# Altium schematic sheet ORD_POWER.SchDoc
size 420 x 297 mm; Address1: Address1; Address2: Address2; Address3: Address3; Address4: Address4; DocumentNumber: АБВГ.123456.001 Э3; SheetNumber: 1; Scale: 1:1; DocumentType: Схема электрическая принципиальная; FirstReferrence: АБВГ.123456.001
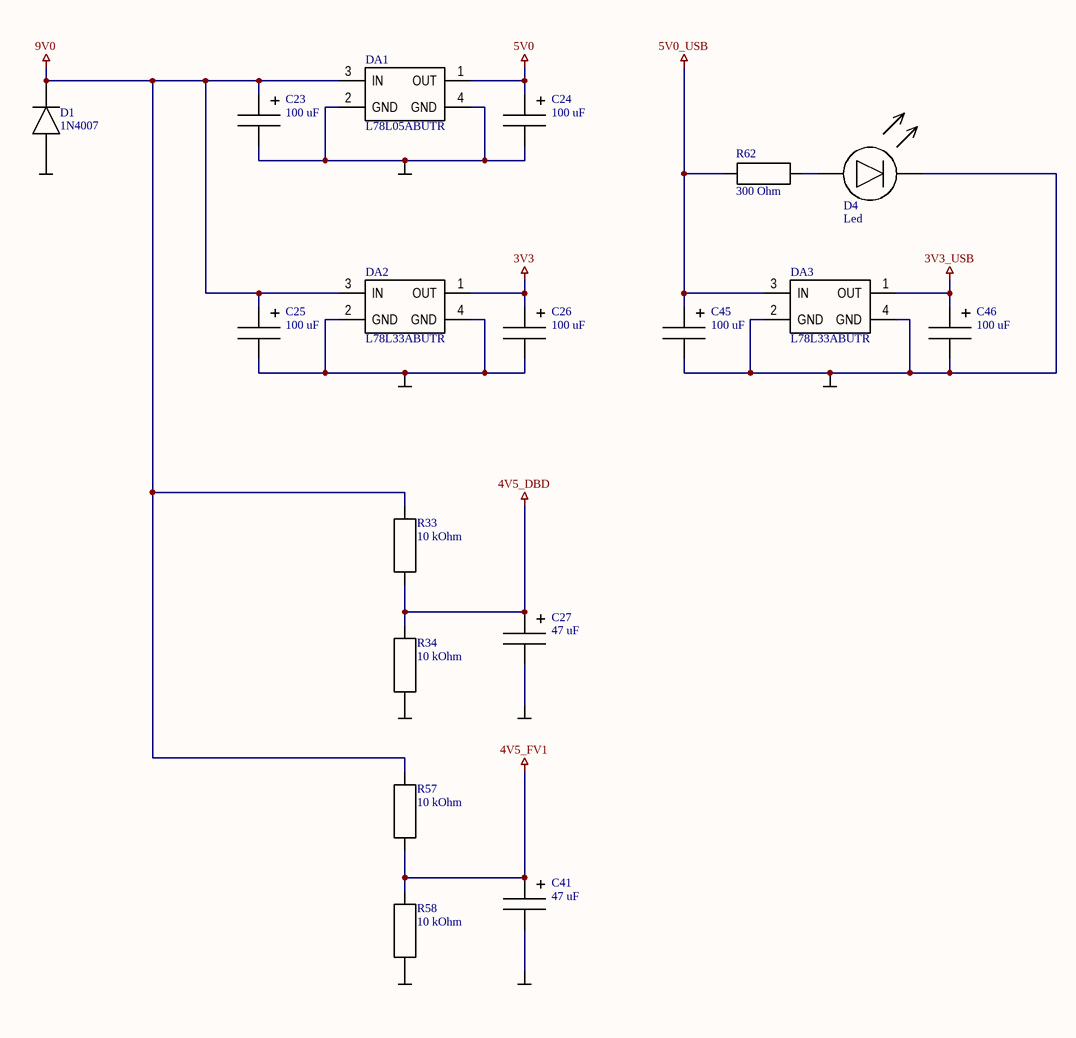
[diagram p0: ORD_POWER.SchDoc]

## Parts
C23  100 uF  [K50-35]
C24  100 uF  [K50-35]
C25  100 uF  [K50-35]
C26  100 uF  [K50-35]
C27  47 uF  [C3528_CASE-B]
C41  47 uF  [C3528_CASE-B]
C45  100 uF  [K50-35]
C46  100 uF  [K50-35]
D1  1N4007  [DO-41]
D4  Led  [LED]
DA1  L78L05ABUTR  [SOT-89]
DA2  L78L33ABUTR  [SOT-89]
DA3  L78L33ABUTR  [SOT-89]
R33  10 kOhm  [R0805[2012]]
R34  10 kOhm  [R0805[2012]]
R57  10 kOhm  [R0805[2012]]
R58  10 kOhm  [R0805[2012]]
R62  300 Ohm  [R0805[2012]]

## Nets
3V3: C26.1 DA2.1(OUT)
3V3_USB: C46.1 DA3.1(OUT)
4V5_DBD: C27.1 R33.1 R34.2
4V5_FV1: C41.1 R57.1 R58.2
5V0: C24.1 DA1.1(OUT)
5V0_USB: C45.1 DA3.3(IN) R62.2
9V0: C23.1 C25.1 D1.1(K) DA1.3(IN) DA2.3(IN) R33.2 R57.2
GND: C23.2 C24.2 C25.2 C26.2 C27.2 C41.2 C45.2 C46.2 D1.2(A) D4.2 DA1.2(GND) DA1.4(GND) DA2.2(GND) DA2.4(GND) DA3.2(GND) DA3.4(GND) R34.1 R58.1
NetD4_1: D4.1 R62.1

## Notes on the sheet
- Перв. примен.
- Справ. №
- Подп. и дата
- Инв. № дубл.
- Взам. инв. №
- Разраб.
- Изм.
- Лист
- № докум.
- Подп.
- Дата
- Лит.
- Масса
- Масштаб
- Пров.
- Т.контр.
- Листов
- Инв. № подл.
- Утв.
- Н.контр.
- 2.106-A3
- Копировал
- Формат А3

## Library data of the parts
C23-C27 C41 C45 C46 = Capacitor_Pol: Manufacture: *; ManufacturerPartNumber: *; Power/Voltage: *; Quantity: *; Rem: *; TKE: *; Tolerance: *; Корпус: *; Примечание: *
  C23-C26 C45 C46: Value: 100 uF
  C27 C41: Value: 47 uF
D1 = 1N4007: Geometry.Height: 1.35mm; Manufacturer_Name: 1N4007; Manufacturer_Part_Number: 1N4007
DA1 = L78L05ABUTR: Standard Regulator Pos 5V 0.1A L78L05ABUTR, Single Linear Voltage Regulator, 100mA 5 V, 3-Pin SOT-89; Manufacturer_Name: New Japan Radio; Manufacturer_Part_Number: NJM78L05UA-TE1; Allied_Number: R1030699; Mouser Part Number: *; Mouser Price/Stock: *; RS Part Number: 7139502P; RS Price/Stock: http://uk.rs-online.com/web/p/products/7139502P; Allied Price/Stock: https://www.alliedelec.com/new-japan-radio-njm78l05ua-te1/R1030699/; Datasheet Link: http://uk.rs-online.com/web/p/products/7139502
DA2 DA3 = L78L33ABUTR: Standard Regulator Pos 3.3V 0.1A L78L33ABUTR, Single Linear Voltage Regulator, 100mA 3.3 V, 3-Pin SOT-89; Manufacturer_Name: New Japan Radio; Manufacturer_Part_Number: NJM78L05UA-TE1; Allied_Number: R1030699; Mouser Part Number: *; Mouser Price/Stock: *; RS Part Number: 7139502P; RS Price/Stock: http://uk.rs-online.com/web/p/products/7139502P; Allied Price/Stock: https://www.alliedelec.com/new-japan-radio-njm78l05ua-te1/R1030699/; Datasheet Link: http://uk.rs-online.com/web/p/products/7139502
R33 R34 R57 R58 R62 = Resistor: Manufacture: *; ManufacturerPartNumber: *; Power/Voltage: *; Quantity: *; Rem: *; TKE: *; Tolerance: *; Корпус: *; Примечание: *
  R33 R34 R57 R58: Value: 10 kOhm
  R62: Value: 300 Ohm
D4 = Led: ManufacturerPartNumber: *